# Altium schematic sheet main.SchDoc
size A4
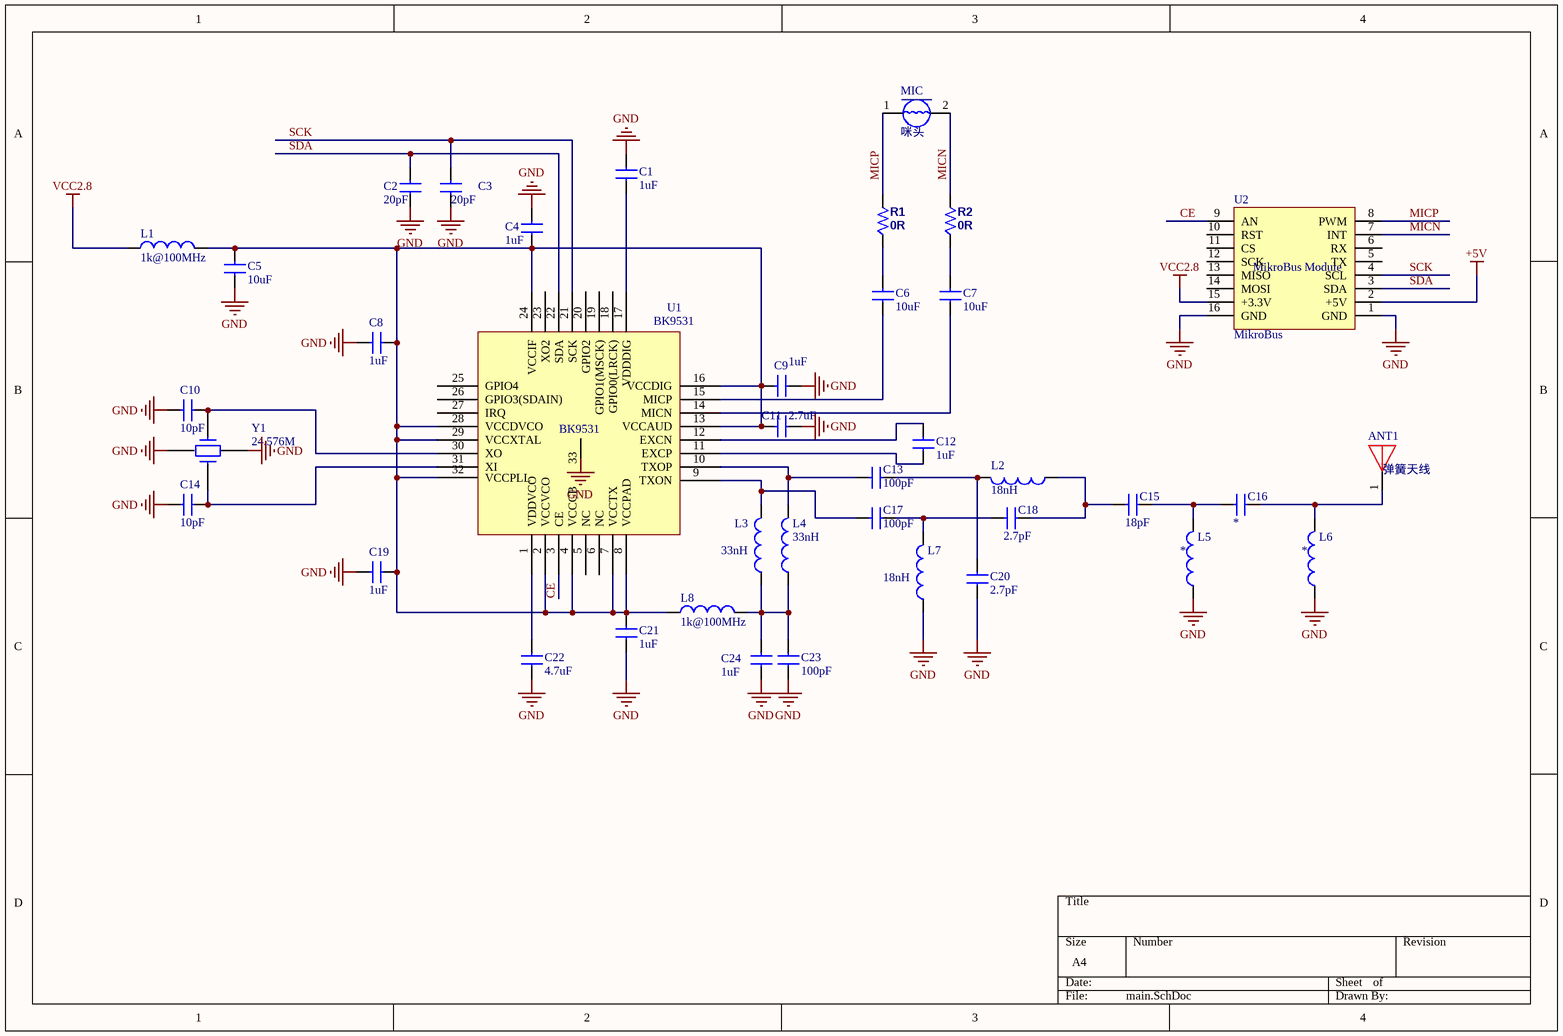
[diagram p0: main.SchDoc]

## Parts
ANT1  弹簧天线  [ANT]
C1  1uF  [C0603]
C2  20pF  [C0603]
C3  20pF  [C0603]
C4  1uF  [C0603]
C5  10uF  [C0603]
C6  10uF  [C0603]
C7  10uF  [C0603]
C8  1uF  [C0603]
C9  1uF  [C0603]
C10  10pF  [C0603]
C11  2.7uF  [C0603]
C12  1uF  [C0603]
C13  100pF  [C0603]
C14  10pF  [C0603]
C15  18pF  [C0603]
C16  *  [C0603]
C17  100pF  [C0603]
C18  2.7pF  [C0603]
C19  1uF  [C0603]
C20  2.7pF  [C0603]
C21  1uF  [C0603]
C22  4.7uF  [C0603]
C23  100pF  [C0603]
C24  1uF  [C0603]
L1  1k@100MHz  [L0603]
L2  18nH  [L0603]
L3  33nH  [L0603]
L4  33nH  [L0603]
L5  *  [L0603]
L6  *  [L0603]
L7  18nH  [L0603]
L8  1k@100MHz  [L0603]
MIC  咪头  [MIC]
R1  0R  [R0603]
R2  0R  [R0603]
U1  BK9531  [QFN32]
U2  MikroBus  [MikroBus]
Y1  24.576M  [晶振   有源2520]

## Nets
+5V: U2.2(+5V)
GND: C1.2 C2.1 C3.1 C4.2 C5.1 C8.1 C9.1 C10.2 C11.1 C14.2 C19.1 C20.1 C21.2 C22.2 C23.2 C24.2 L5.1 L6.1 L7.1 U1.33 U2.1(GND) U2.16(GND) Y1.2 Y1.4
VCC2.8: L1.1 U2.15(+3.3V)
CE: U1.3(CE) U2.9(AN)
MICN: MIC.2 R2.2 U2.7(INT)
MICP: MIC.1 R1.2 U2.8(PWM)
SCK: C3.2 U1.21(SCK) U2.4(SCL)
SDA: C2.2 U1.22(SDA) U2.3(SDA)
NetANT1_1: ANT1.1 C16.1 L6.2
NetC1_1: C1.1 U1.17(VDDDIG)
NetC4_1: C4.1 C5.2 C8.2 C9.2 C11.2 C19.2 C21.1 L1.2 L8.1 U1.2(VCCVCO) U1.4(VCCCB) U1.7(VCCTX) U1.8(VCCPAD) U1.13(VCCAUD) U1.16(VCCDIG) U1.24(VCCIF) U1.28(VCCDVCO) U1.29(VCCXTAL) U1.32(VCCPLL)
NetC6_1: C6.1 R1.1
NetC6_2: C6.2 U1.15(MICP)
NetC7_1: C7.1 R2.1
NetC7_2: C7.2 U1.14(MICN)
NetC10_1: C10.1 U1.30(XO) Y1.3
NetC12_1: C12.1 U1.12(EXCN)
NetC12_2: C12.2 U1.11(EXCP)
NetC13_1: C13.1 L4.2 U1.10(TXOP)
NetC13_2: C13.2 C20.2 L2.2
NetC14_1: C14.1 U1.31(XI) Y1.1
NetC15_1: C15.1 C16.2 L5.2
NetC15_2: C15.2 C18.1 L2.1
NetC17_1: C17.1 L3.2 U1.9(TXON)
NetC17_2: C17.2 C18.2 L7.2
NetC22_1: C22.1 U1.1(VDDVCO)
NetC23_1: C23.1 C24.1 L3.1 L4.1 L8.2

Not connected (* = marked no-connect by the designer): U1 5(NC) 6(NC) 18(GPIO0(LRCK)) 19(GPIO1(MSCK)) 20(GPIO2) 23(XO2) 25(GPIO4) 26(GPIO3(SDAIN)) 27(IRQ); U2 5(TX) 6(RX) 10(RST) 11(CS) 12(SCK) 13(MISO) 14(MOSI)

## Notes on the sheet
- (in symbol MikroBus) MikroBus Module

## Library data of the parts
ANT1 = ANT
C1-C24 = CAP 0603-10pF/50V: 0603-10pF/50V 贴片层叠电容; 物料代码: 3.01.02.02.01.01.0028; 助记码: 0603-10pF/50V TPCDDR; 仓库名称: 元件仓; 单位: 只; 加工类型: 贴片; 物料名称: 0603-10pF/50V 贴片层叠电容; 规格型号: *
L1-L8 = 电感  贴片  33UH: 磁珠; 物料名称: *; 物料代码: *; 备注: *; 助记码: *; 单位: *; 规格型号: *
MIC = MIC
R1 R2 = RES1: 1206  K  5%  HS  贴片电阻
U1 = BK9531: QFN5x5 32
Y1 = 晶振  24.576MHz  49SMD: （未入库）24.576MHz  2520; 仓库名称: 元件仓; 单位: 只; 加工方式: 贴片